# Altium schematic sheet Adder.SchDoc
size A; SheetNumber: 1; SheetTotal: 6
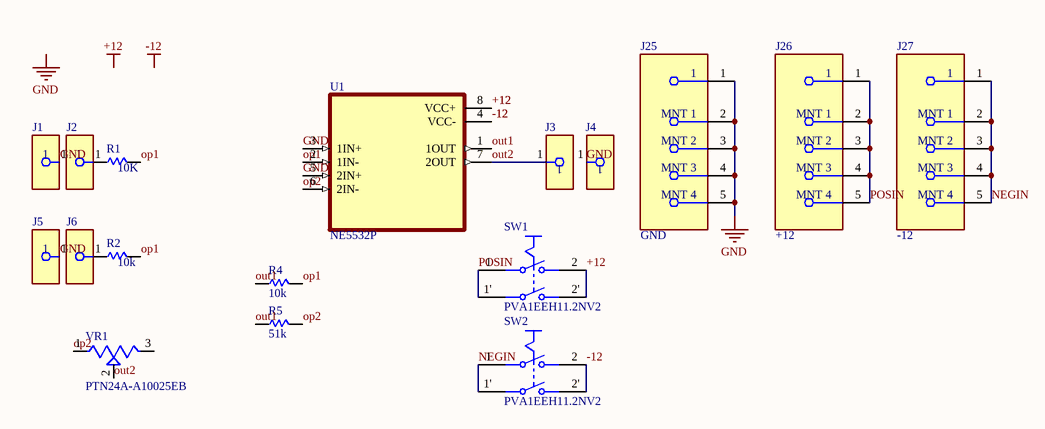
[diagram p0: Adder.SchDoc]

## Parts
J1  (no value)  [FP-1581-5-MFG]
J2  1581-5  [FP-1581-5-MFG]  (value not drawn)
J3  1581-5  [FP-1581-5-MFG]  (value not drawn)
J4  1581-5  [FP-1581-5-MFG]  (value not drawn)
J5  1581-5  [FP-1581-5-MFG]  (value not drawn)
J6  1581-5  [FP-1581-5-MFG]  (value not drawn)
J25  GND  [FP-FCR7350B-MFG]
J26  +12  [FP-FCR7350B-MFG]
J27  -12  [FP-FCR7350B-MFG]
R1  value 10K  [RESAD1100W55L680D260]  (hidden comment: MFR-25FBF52-1K)
R2  value 10k  [RESAD1100W55L680D260]  (hidden comment: MFR-25FBF52-1K)
R4  value 10k  [RESAD1100W55L680D260]  (hidden comment: MFR-25FBF52-1K)
R5  value 51k  [RESAD1100W55L680D260]  (hidden comment: MFR-25FBF52-1K)
SW1  PVA1EEH11.2NV2  [FP-PVA1EEH11_2NV2-MFG]
SW2  PVA1EEH11.2NV2  [FP-PVA1EEH11_2NV2-MFG]
U1  NE5532P  [DIP794W45P254L959H508Q8]
VR1  PTN24A-A10025EB  [TRIM_PTN24A-A10025EB]

## Nets
+12: SW1.2 SW1.2' U1.8(VCC+)
-12: SW2.2 SW2.2' U1.4(VCC-)
GND: J1.1 J4.1 J5.1 J25.1 J25.2(MNT_1) J25.3(MNT_2) J25.4(MNT_3) J25.5(MNT_4) U1.3(1IN+) U1.5(2IN+)
NEGIN: J27.1 J27.2(MNT_1) J27.3(MNT_2) J27.4(MNT_3) J27.5(MNT_4) SW2.1 SW2.1'
op1: R1.2 R2.2 R4.2 U1.2(1IN-)
op2: R5.2 U1.6(2IN-) VR1.1
out1: R4.1 R5.1 U1.1(1OUT)
out2: J3.1 U1.7(2OUT) VR1.2
POSIN: J26.1 J26.2(MNT_1) J26.3(MNT_2) J26.4(MNT_3) J26.5(MNT_4) SW1.1 SW1.1'
NetJ2_1: J2.1 R1.1
NetJ6_1: J6.1 R2.1

Not connected (* = marked no-connect by the designer): VR1 3

## Notes on the sheet
- Labels drawn without touching a wire or pin: +12, -12, GND

## Library data of the parts
J1-J6 = CMP-73906-000011-1: CONN BANANA JACK TURRET GREEN; Body Material: PC; Number of Contacts: 1; Max Current Rating: 15A; Voltage Rating (AC): 30V; Insulation: Mating End Insulated; Voltage Rating: 2.5kV; Voltage Rating (DC): 60V; Gender: Female; Height: 0.25inch; Mount: Panel; RoHS Compliant: Yes; Length: 1.22inch; Orientation: Straight; Diameter: 4.22mm; Lead Free: Lead Free; Package Quantity: 1; Termination: Turret; Current Rating: 15A; Packaging: Bag; Series: 1581; REACH SVHC: No SVHC; Number of Positions: 1; Contact Plating: Tin; Housing Color: Green; Contact Material: Brass; Insulation Material: Polycarbonate; Weight: 0.126lb; Number of Ports: 1; Color: Green; Housing Material: Polycarbonate; Width: 4inch
J25-J27 = CMP-213418-000001-1: 4MM PANEL SKT S16N-PC BLACK; Voltage Rating: 1kV; Gender: Receptacle; Connector Type: Socket; Current Rating: 24A; Pin Diameter: 4mm; Color: Black; Contact Material: Gold; Termination: Through Hole; Weight: 0.1lb; Height: 1.3inch; Width: 0.43inch; REACH SVHC: No SVHC; Voltage Rating (DC): 1kV; RoHS Compliant: Yes; Insulation Material: PVC; Length: 0.47inch; Mount: Through Hole; Contact Plating: Gold
R1 R2 R4 R5 = MFR-25FBF52-1K: 1.07 kOhms Â±1% 0.25W, 1/4W Through Hole Resistor Axial - Metal Film; MF: Yageo; SnapEDA_Link: https://www.snapeda.com/parts/MFR-25FBF52-1K/Yageo/view-part/?ref=snap; Package: RADIAL-2 YAGEO; MP: MFR-25FBF52-1K; Check_prices: https://www.snapeda.com/parts/MFR-25FBF52-1K/Yageo/view-part/?ref=eda
SW1 SW2 = CMP-10035-000009-1: SWITCH PUSH DPST 0.1A 32V; Switch Function: Off-On; Current Rating: 100mA; Electrical Life: 100000Cycles; RoHS Compliant: Yes; Throw Configuration: DPST; Max Operating Temperature: 85°C; Voltage Rating (DC): 32V; Mount: Through Hole; Series: PVA; Min Operating Temperature: -40°C; Termination: PC Pin; Packaging: Bulk
U1 = NE5532P: Dual, 30-V, 10-MHz, low-noise operational amplifier for audio applications; MF: Texas Instruments; SnapEDA_Link: https://www.snapeda.com/parts/NE5532P/Texas+Instruments/view-part/?ref=snap; Package: PDIP-8 Texas; Value: *; MP: NE5532P; Check_prices: https://www.snapeda.com/parts/NE5532P/Texas+Instruments/view-part/?ref=eda
VR1 = PTN24A-A10025EB: 100k Ohm 1 Gang Linear Panel Mount Potentiometer 1.0 Turns Carbon 0.5W, 1/2W PC Pins; MF: Same Sky; SnapEDA_Link: https://www.snapeda.com/parts/PTN24A-A10025EB/Same+Sky/view-part/?ref=snap; Package: Package; Value: *; MP: PTN24A-A10025EB; Check_prices: https://www.snapeda.com/parts/PTN24A-A10025EB/Same+Sky/view-part/?ref=eda